# Altium schematic sheet CH32V006-WUI-R1.SchDoc
size 274 x 287 mm; Symbol: Sheet-Symbol_A4; Company: Caesar; Drawed: Caesar; Reviewed: Caesar; Version: V1.0; Page Size: A4; @Project Name: CH32X035G8U6_Multifunctional_Keyboard-1v3-20240412; @Page Count: 1; @Update Date: 2024-04-12; @Create Date: 2024-03-18; @Schematic Name: Schematic1; @Page No: 1; @Page Name: P1; Device: Sheet-Symbol_A4; SheetNumber: 1; SheetTotal: 1
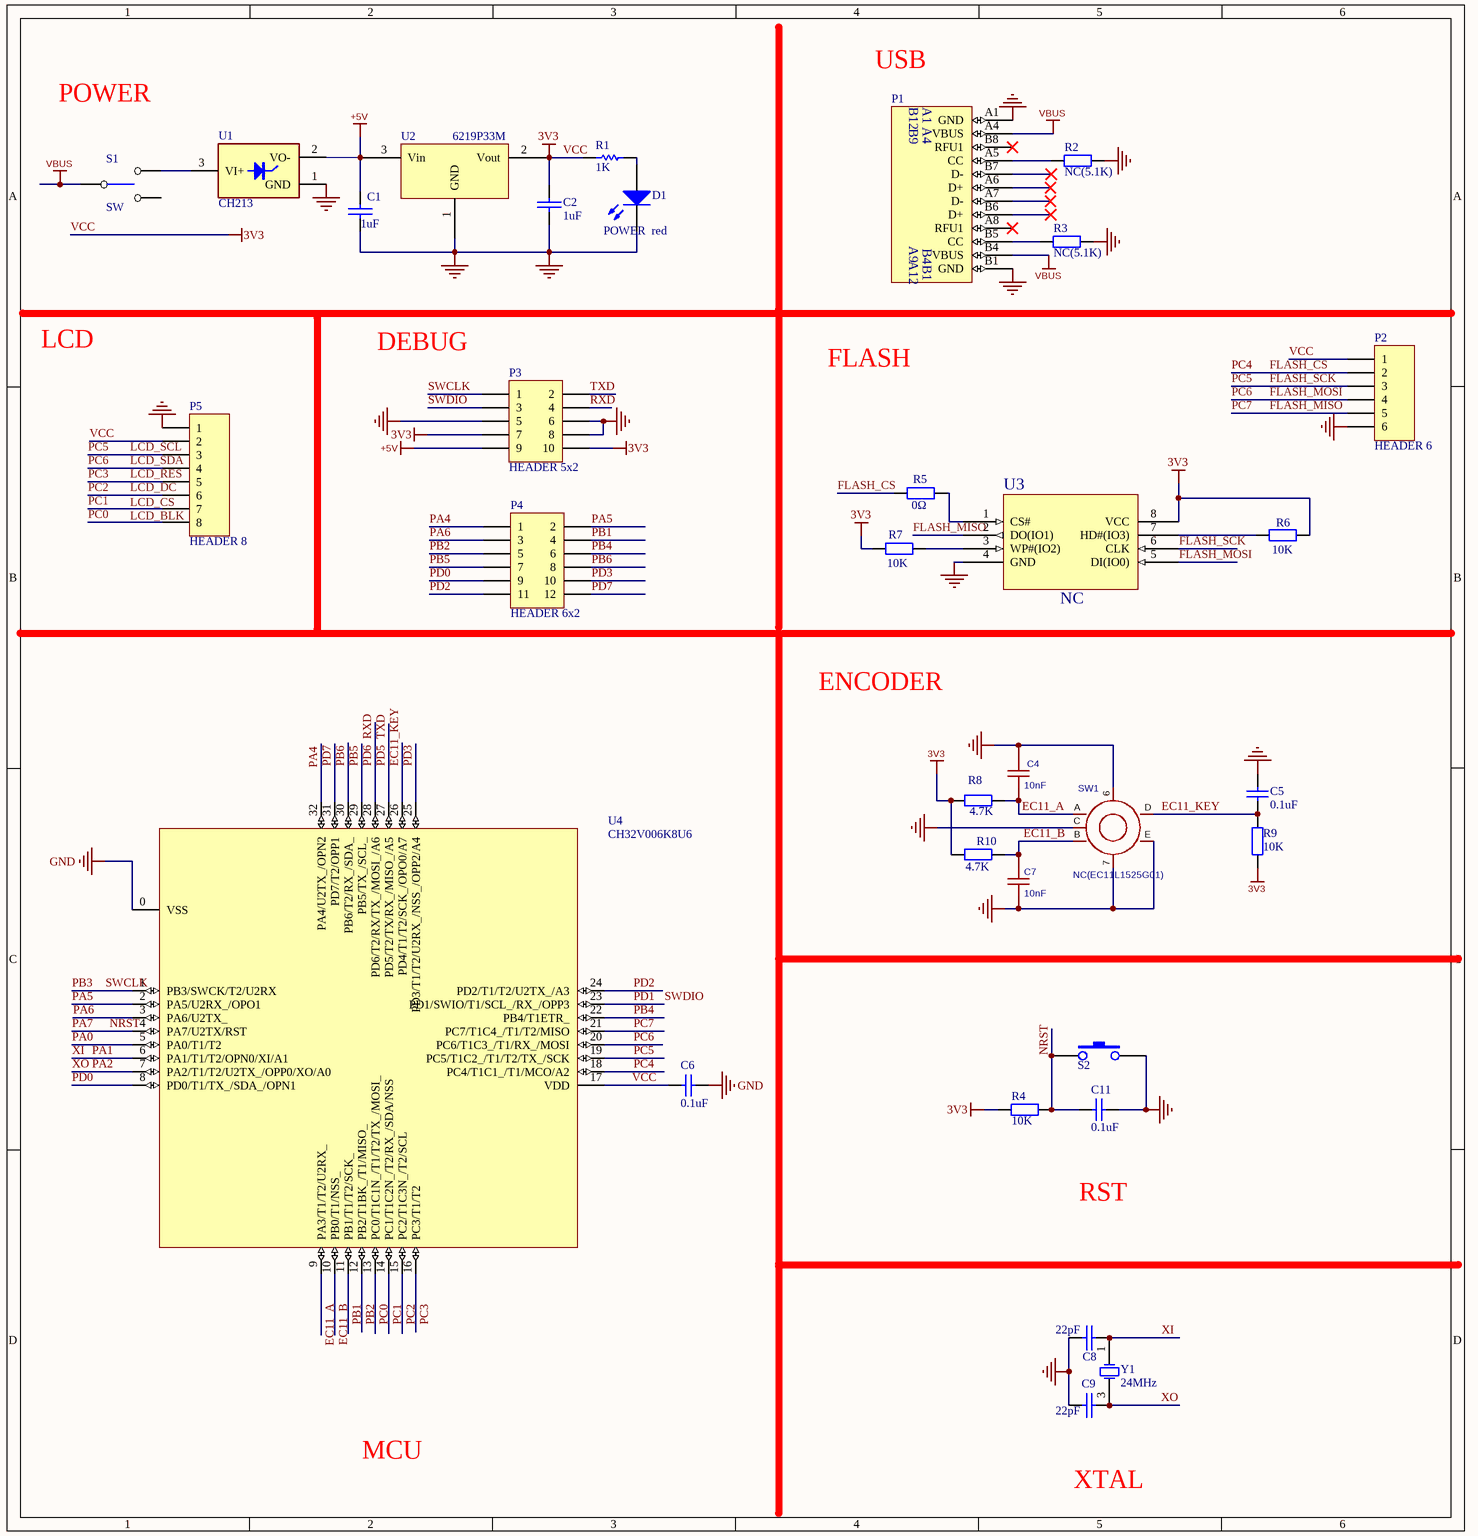
[diagram p0: CH32V006-WUI-R1.SchDoc]

## Parts
C1  1uF  [0402_C]
C2  1uF  [0402_C]
C4  10nF  [0402_C]
C5  0.1uF  [0402_C]
C6  0.1uF  [0402_C]
C7  10nF  [0402_C]
C8  22pF  [0402_C]
C9  22pF  [0402_C]
C11  0.1uF  [0402_C]
D1  POWER  red  [0603+]
P1  TYPE-C  [TYPE-C-Receptacle-2.0]  (value not drawn)
P2  HEADER 6  [SIP6-2.54mm]
P3  HEADER 5x2  [IDC10-2.54mm]
P4  HEADER 6x2  [IDC12-2.54mm]
P5  HEADER 8  [SIP8-2.54mm]
R1  1K  [0402]
R2  NC(5.1K)  [0402]
R3  NC(5.1K)  [0402]
R4  10K  [0402]
R5  0Ω  [0402]
R6  10K  [0402]
R7  10K  [0402]
R8  4.7K  [0402]
R9  10K  [0402]
R10  4.7K  [0402]
S1  SW  [SW1]
S2  NRST  [贴片按键]  (value not drawn)
SW1  NC(EC11L1525G01)  [SW-TH_ALPS_EC11L1525G01]
U1  CH213  [SOT-23-3]
U2  6219P33M  [SOT-23]
U3  NC  [SOIC-8_208mil]
U4  CH32V006K8U6  [QFN32_4X4]
Y1  24MHz  [XT3225]

## Nets
+5V: C1.1 P3.9 U1.2(VO-) U2.3(Vin)
GND: C1.2 C2.2 C4.2 C5.1 C6.2 C7.2 C8.1 C9.1 C11.1 D1.2(K) P1.A1(GND) P1.B1(GND) P2.6 P3.5 P3.6 P3.8 P5.1 R2.2 R3.2 S2.2 SW1.6(EH) SW1.7(EH) SW1.C SW1.E U1.1(GND) U2.1(GND) U3.4(GND) U4.0(VSS)
VBUS: P1.A4(VBUS) P1.B4(VBUS) S1.1
VCC: C2.1 C6.1 P2.1 P3.7 P3.10 P5.2 R1.2 R4.2 R6.2 R7.1 R8.1 R9.1 R10.1 U2.2(Vout) U3.8(VCC) U4.17(VDD)  [also labelled 3V3]
EC11_A: C4.1 R8.2 SW1.A U4.9(PA3/T1/T2/U2RX_)
EC11_B: C7.1 R10.2 SW1.B U4.10(PB0/T1/NSS_)
EC11_KEY: C5.2 R9.2 SW1.D U4.26(PD4/T1/T2/SCK_/OPO0/A7)
FLASH_CS: P2.2 R5.1 U4.18(PC4/T1C1_/T1/MCO/A2)  [also labelled PC4]
FLASH_MISO: P2.5 U3.2(DO(IO1)) U4.21(PC7/T1C4_/T1/T2/MISO)  [also labelled PC7]
FLASH_MOSI: P2.4 P5.4 U3.5(DI(IO0)) U4.20(PC6/T1C3_/T1/RX_/MOSI)  [also labelled LCD_SDA, PC6]
FLASH_SCK: P2.3 P5.3 U3.6(CLK) U4.19(PC5/T1C2_/T1/T2/TX_/SCK)  [also labelled LCD_SCL, PC5]
LCD_DC: P5.6 U4.15(PC2/T1C3N_/T2/SCL)  [also labelled PC2]
LCD_RES: P5.5 U4.16(PC3/T1/T2)  [also labelled PC3]
NRST: C11.2 R4.1 S2.1 U4.4(PA7/U2TX/RST)  [also labelled PA7]
PA0: U4.5(PA0/T1/T2)
PA1: C8.2 U4.6(PA1/T1/T2/OPN0/XI/A1) Y1.1(OSC1)  [also labelled XI]
PA2: C9.2 U4.7(PA2/T1/T2/U2TX_/OPP0/XO/A0) Y1.3(OSC2)  [also labelled XO]
PA4: P4.1 U4.32(PA4/U2TX_/OPN2)
PA5: P4.2 U4.2(PA5/U2RX_/OPO1)
PA6: P4.3 U4.3(PA6/U2TX_)
PB1: P4.4 U4.11(PB1/T1/T2/SCK_)
PB2: P4.5 U4.12(PB2/T1BK_/T1/MISO_)
PB3: P3.1 U4.1(PB3/SWCK/T2/U2RX)  [also labelled SWCLK]
PB4: P4.6 U4.22(PB4/T1ETR_)
PB5: P4.7 U4.29(PB5/TX_/SCL_)
PB6: P4.8 U4.30(PB6/T2/RX_/SDA_)
PC0: P5.8 U4.13(PC0/T1C1N_/T1/T2/TX_/MOSI_)
PC1: P5.7 U4.14(PC1/T1C2N_/T2/RX_/SDA/NSS)
PD0: P4.9 U4.8(PD0/T1/TX_/SDA_/OPN1)
PD1: P3.3 U4.23(PD1/SWIO/T1/SCL_/RX_/OPP3)  [also labelled SWDIO]
PD2: P4.11 U4.24(PD2/T1/T2/U2TX_/A3)
PD3: P4.10 U4.25(PD3/T1/T2/U2RX_/NSS_/OPP2/A4)
PD5: P3.2 U4.27(PD5/T2/TX/RX_/MISO_/A5)  [also labelled TXD]
PD6: P3.4 U4.28(PD6/T2/RX/TX_/MOSI_/A6)  [also labelled RXD]
PD7: P4.12 U4.31(PD7/T2/OPP1)
NetD1_1: D1.1(A) R1.1
NetP1_A5: P1.A5(CC) R2.1
NetP1_B5: P1.B5(CC) R3.1
NetR5_2: R5.2 U3.1(CS#)
NetR6_1: R6.1 U3.7(HD#(IO3))
NetR7_2: R7.2 U3.3(WP#(IO2))
NetS1_3: S1.3 U1.3(VI+)

Not connected (* = marked no-connect by the designer): P1 A6(D+)* A7(D-)* A8(RFU1)* B6(D+)* B7(D-)* B8(RFU1)*; S1 2

## Notes on the sheet
- USB
- POWER
- LCD
- DEBUG
- FLASH
- ENCODER
- RST
- MCU
- XTAL
- Labels drawn without touching a wire or pin: LCD_BLK, LCD_CS
- 更新日期
- 2024-04-12
- 原理图
- 图页
- Schematic1
- P1
- 创建日期
- 物料编码
- 2024-03-18
- 审阅
- 绘制
- Caesar
- CH32X035G8U6_Multifunctional_Keyboard-1v3-20240412
- 版本
- V1.0
- 尺寸
- A4
- 页
- 1
- 共
- (in symbol TYPE-C1) B12; B9; A9; A12

## Library data of the parts
C1 C2 C8 C9 = CAP: Capacitor
C4 C7 = CAP_0603: ConvertToPcb: yes; SymbolName: CapAcitance; ModelId: ac125912035d415993ca9572d50418b1; ModelName: C0603_L1.6-W0.8-H0.8; ModelTransform: 62.992,31.496,0,0,0,0,0,0,0; Value: 10nF; Device: CAP_0603; AddInBom: yes; Supplier Footprint: 0603; FootprintName: C0603
C5 C11 = Cap: Capacitor; Published: 8-Jun-2000; LatestRevisionDate: 17-Jul-2002; LatestRevisionNote: Re-released for DXP Platform.; PackageReference: RAD-0.3; Publisher: Altium Limited; Value: 0.1uF
C6 = Cap: Capacitor; Value: 15pF; Published: 8-Jun-2000; LatestRevisionDate: 17-Jul-2002; LatestRevisionNote: Re-released for DXP Platform.; PackageReference: RAD-0.3; Publisher: Altium Limited
D1 = LED0: Typical INFRARED GaAs LED; Published: 8-Jun-2000; LatestRevisionDate: 08-Jul-2005; LatestRevisionNote: Mech Layer 1 removed.; PackageReference: LED-0; Publisher: Altium Limited
P1 = TYPE-C1
P2 = HEADER 6: Header, 6-Pin
P3 = HEADER 5x2: Header, 5-Pin, Dual row
P4 = HEADER 6x2: Header, 6-Pin, Dual row
P5 = HEADER 8: Header, 8-Pin
R1 = Res Semi: Semiconductor Resistor; Published: 8-Jun-2000; LatestRevisionDate: 17-Jul-2002; LatestRevisionNote: Re-released for DXP Platform.; PackageReference: AXIAL-0.5; Publisher: Altium Limited; Value: 1K
R2-R4 R6 R7 R9 = Res2: Resistor
  R4 R6 R7 R9: Published: 8-Jun-2000; LatestRevisionDate: 17-Jul-2002; LatestRevisionNote: Re-released for DXP Platform.; PackageReference: AXIAL-0.4; Publisher: Altium Limited; Value: 10K
R5 R8 R10 = Res2: Resistor; Value: 10K; Published: 8-Jun-2000; LatestRevisionDate: 17-Jul-2002; LatestRevisionNote: Re-released for DXP Platform.; PackageReference: AXIAL-0.4; Publisher: Altium Limited
S2 = KEY
SW1 = EC11L1525G01: Manufacturer: ALPSALPINE(阿尔卑斯阿尔派); AddInBom: yes; ModelId: cf33b882906a4832899d48957bbfbd3a; ModelTransform: 515.67818,588.582,0,0,0,0,-0.003,0,-137.795; Symbol: EC11L1525G01; Device: EC11L1525G01; LCSC Part Name: EC11L1525G01; SupplierPart: C2991196; ManufacturerPart: EC11L1525G01; Supplier Footprint: 插件; JLCPCB Part Class: 扩展库; Datasheet: https://atta.szlcsc.com/upload/public/pdf/source/20220411/178C78D91D042177C355D008FA29ADBD.pdf; Supplier: LCSC; ConvertToPcb: yes; FootprintName: SW-TH_ALPS_EC11L1525G01; ModelName: SW-TH_ALPS_EC11L1525G01
U1 = CH213E: Ideal Diode 5V*1A
U3 = W25Q32JV
U4 = CH32V006K8U6: RISC-V MCU, 48MHz, ADC/OPA/2*UART/I2C/SPI
Y1 = XTAL: Crystal Oscillator; Published: 8-Jun-2000; LatestRevisionDate: 17-Jul-2002; LatestRevisionNote: Re-released for DXP Platform.; PackageReference: R38; Publisher: Altium Limited; PackageDescription: Crystal, Thru-Hole; 2 Leads; Body 3.1 x 8.2 mm (Dia.xH)